# Altium project altium-senior-project-small.PrjPcb
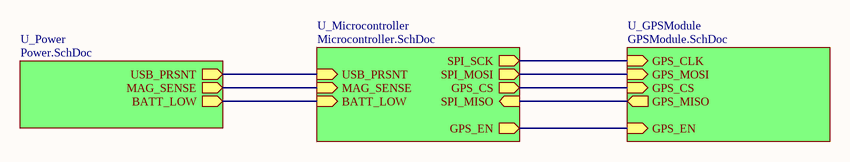
[diagram p0: topLevel.SchDoc]
4 sheets, 48 parts. Net scope: hierarchical (ports join the sheet entries above them; power ports are global).
Board file: smallCollar_AA.PcbDoc
Sheets:
  topLevel.SchDoc
    U_Microcontroller = Microcontroller.SchDoc
    U_GPSModule = GPSModule.SchDoc
    U_Power = Power.SchDoc

## Sheet topLevel.SchDoc: Top Level Schematic
size A4; Revision: AA; SheetNumber: 1; SheetTotal: 4; ImagePath: "D:\git\altium-senior-project\gvsu_logo.jpg"

### Sub-sheets
U_GPSModule = GPSModule.SchDoc: GPS_CLK (in), GPS_MISO (out), GPS_MOSI (in), GPS_CS (in), GPS_EN (in)
U_Microcontroller = Microcontroller.SchDoc: SPI_SCK (out), SPI_MISO (in), SPI_MOSI (out), GPS_CS (out), GPS_EN (out), USB_PRSNT (in), MAG_SENSE (in), BATT_LOW (in)
U_Power = Power.SchDoc: USB_PRSNT (out), MAG_SENSE (out), BATT_LOW (out)

### Nets
GPS_CS: sheet U_Microcontroller/GPS_CS, sheet U_GPSModule/GPS_CS
MISO: sheet U_Microcontroller/SPI_MISO, sheet U_GPSModule/GPS_MISO
MOSI: sheet U_Microcontroller/SPI_MOSI, sheet U_GPSModule/GPS_MOSI
SCK: sheet U_Microcontroller/SPI_SCK, sheet U_GPSModule/GPS_CLK
NetQ2_2: sheet U_Microcontroller/USB_PRSNT, sheet U_Power/USB_PRSNT
NetR1_2: sheet U_Microcontroller/MAG_SENSE, sheet U_Power/MAG_SENSE
NetR5_1: sheet U_Microcontroller/GPS_EN, sheet U_GPSModule/GPS_EN
NetU3_25: sheet U_Microcontroller/BATT_LOW, sheet U_Power/BATT_LOW

### Notes on the sheet
- Title
- Size:
- Date:
- A4
- Number:
- Time:
- Revision:
- Sheet
- of
- Grand Valley State University
- 301 W Fulton St
- Grand Rapids, MI
- 49504
- File:

## Sheet Microcontroller.SchDoc: Microcontroller
size A4; Revision: AA; SheetNumber: 3; SheetTotal: 4; ImagePath: "D:\git\altium-senior-project\gvsu_logo.jpg"
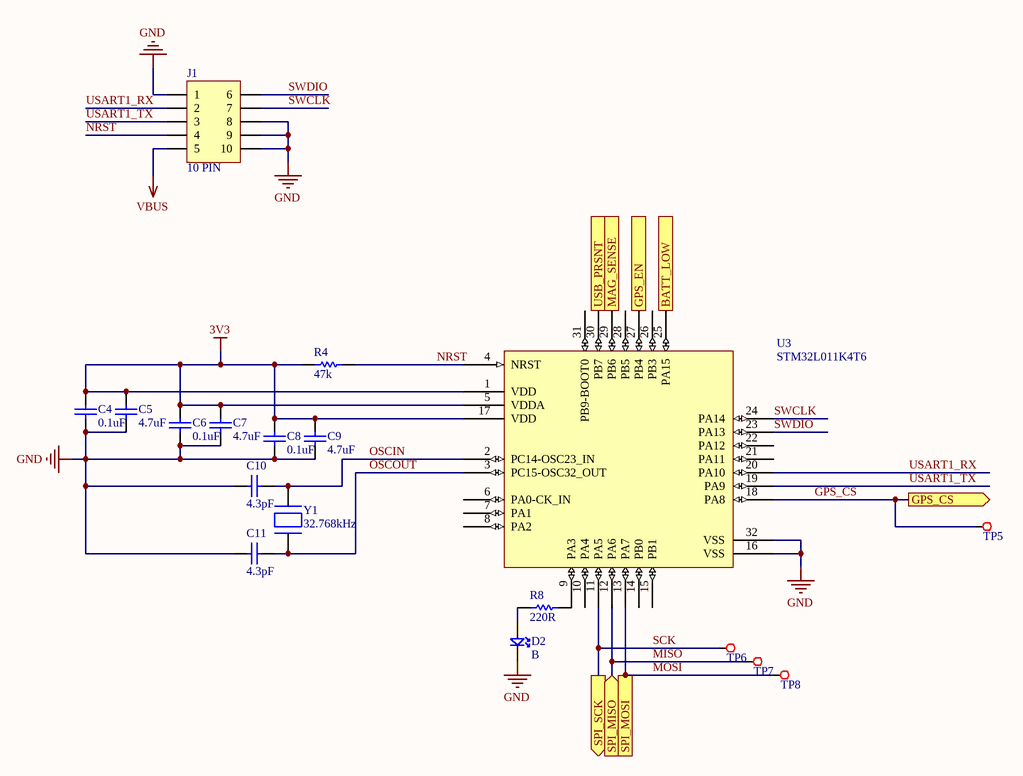
[diagram p1: Microcontroller.SchDoc]

### Parts
C4  value 0.1uF  [0603CAP]  (hidden comment: C0603)
C5  value 4.7uF  [0603CAP]  (hidden comment: C0603)
C6  value 0.1uF  [0603CAP]  (hidden comment: C0603)
C7  value 4.7uF  [0603CAP]  (hidden comment: C0603)
C8  value 0.1uF  [0603CAP]  (hidden comment: C0603)
C9  value 4.7uF  [0603CAP]  (hidden comment: C0603)
C10  value 4.3pF  [0402cap]  (hidden comment: C0402)
C11  value 4.3pF  [0402cap]  (hidden comment: C0402)
D2  value B  [0603DDE]  (hidden comment: D0603)
J1  10 PIN  [FTSH-105-01-F-D-K]
R4  value 47k  [0402RES]  (hidden comment: R0402)
R8  value 220R  [0402RES]  (hidden comment: R0402)
TP5  TESTPOINT  [TP R25]  (value not drawn)  (no BOM)
TP6  TESTPOINT  [TP R35 TH15]  (value not drawn)  (no BOM)
TP7  TESTPOINT  [TP R35 TH15]  (value not drawn)  (no BOM)
TP8  TESTPOINT  [TP R35 TH15]  (value not drawn)  (no BOM)
U3  STM32L011K4T6  [LQFP32]
Y1  32.768kHz  [0.126" L x 0.061" W (2 PAD)]

### Ports
BATT_LOW (in), GPS_CS (out), GPS_EN (out), MAG_SENSE (in), SPI_MISO (in), SPI_MOSI (out), SPI_SCK (out), USB_PRSNT (in)

### Nets
3V3: C4.2 C5.2 C6.2 C7.2 C8.2 C9.2 R4.1 U3.1(VDD) U3.5(VDDA) U3.17(VDD)
GND: C4.1 C5.1 C6.1 C7.1 C8.1 C9.1 C10.1 C11.1 D2.2 J1.1 J1.8 J1.9 J1.10 U3.16(VSS) U3.32(VSS)
VBUS: J1.5
GPS_CS: TP5.1 U3.18(PA8) ; port GPS_CS
MISO: TP7.1 U3.12(PA6) ; port SPI_MISO
MOSI: TP8.1 U3.13(PA7) ; port SPI_MOSI
NRST: J1.4 R4.2 U3.4(NRST)
OSCIN: C10.2 U3.2(PC14-OSC23_IN) Y1.2
OSCOUT: C11.2 U3.3(PC15-OSC32_OUT) Y1.1
SCK: TP6.1 U3.11(PA5) ; port SPI_SCK
SWCLK: J1.7 U3.24(PA14)
SWDIO: J1.6 U3.23(PA13)
USART1_RX: J1.2 U3.20(PA10)
USART1_TX: J1.3 U3.19(PA9)
NetD2_1: D2.1 R8.1
NetQ2_2: U3.30(PB7) ; port USB_PRSNT
NetR1_2: U3.29(PB6) ; port MAG_SENSE
NetR5_1: U3.27(PB4) ; port GPS_EN
NetR8_2: R8.2 U3.9(PA3)
NetU3_25: U3.25(PA15) ; port BATT_LOW

Not connected (* = marked no-connect by the designer): U3 6(PA0-CK_IN) 7(PA1) 8(PA2) 10(PA4) 14(PB0) 15(PB1) 21(PA11) 22(PA12) 26(PB3) 28(PB5) 31(PB9-BOOT0)

### Notes on the sheet
- Title
- Size:
- Date:
- A4
- Number:
- Time:
- Revision:
- Sheet
- of
- Grand Valley State University
- 301 W Fulton St
- Grand Rapids, MI
- 49504
- File:

### Library data of the parts
C4-C9 = C0603: 0603 Ceramic Chip Capacitor - Standard
C10 C11 = C0402: 0402 Ceramic Chip Capacitor - Standard
D2 = D0603: 0603 SMD LED; ComponentLink1URL: *; Forward Voltage Drop: *
J1 = FTSH-105-01-F-D-K: 10 Pin Programming Header; Manufacturer 1: Samtec Inc.; Manufacturer Part Number 1: FTSH-105-01-F-D-K; Supplier 1: Digikey; Supplier Part Number 1: SAM8909-ND
R4 R8 = R0402: 0402 Chip Resistor - Standard; ComponentLink1URL: *
TP5 = TP25: 0.025" Round Test Point; Part Number: 1613; Part Name: Testpoint
TP6-TP8 = TP35TH10: 0.035"/0.015" Thru Hole Test Point; Part Number: 1617; Part Name: Testpoint
U3 = STM32L011K4T6: STMicro ARM M0+ Microcontroller; Manufacturer 1: STMicroelectronics; Manufacturer Part Number 11: STM32L071KZT6; Supplier 1: Digikey; Supplier Part Number 1: 497-18578-ND
Y1 = NX3215SA-32.768K-STD-MUA-8: NDK RTC 12.5pF Crystal SMD; Manufacturer 1: NDK; Manufacturer Part Number 1: NX3215SA-32.768K-STD-MUA-8; Supplier 1: Digikey; Supplier Part Number 1: 644-1156-1-ND

## Sheet GPSModule.SchDoc: GPS Module
size A4; Revision: AA; SheetNumber: 2; SheetTotal: 4
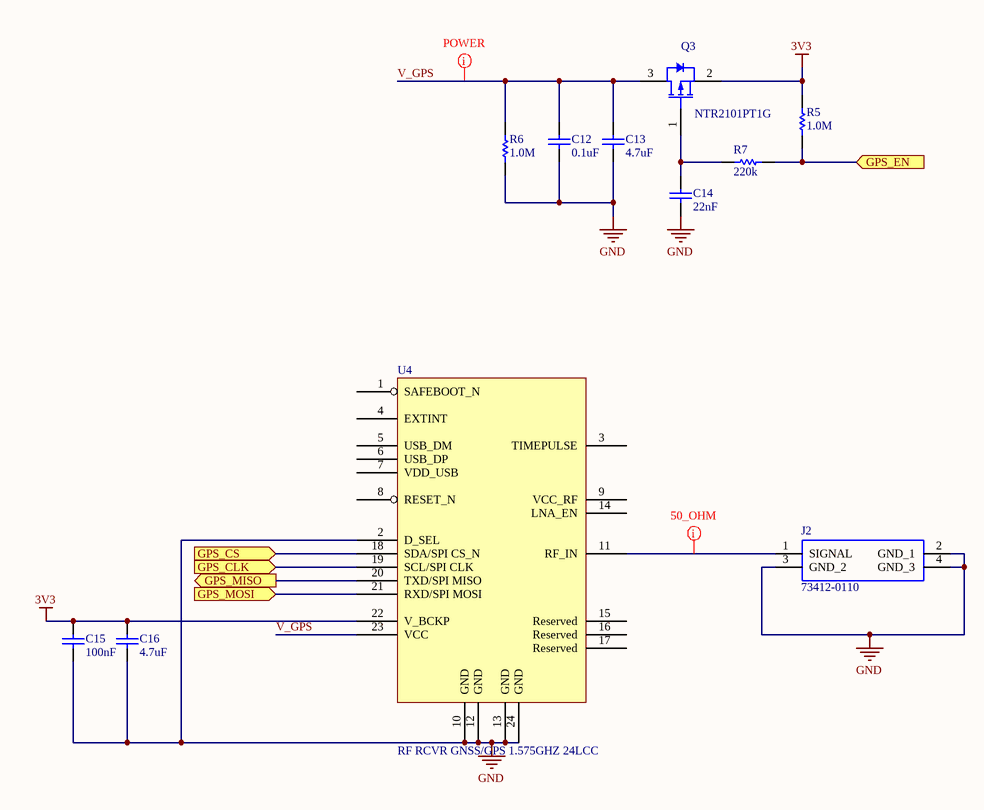
[diagram p2: GPSModule.SchDoc]

### Parts
C12  value 0.1uF  [0402cap]  (hidden comment: C0402)
C13  value 4.7uF  [0603CAP]  (hidden comment: C0603)
C14  value 22nF  [0402cap]  (hidden comment: C0402)
C15  value 100nF  [0402cap]  (hidden comment: C0402)
C16  value 4.7uF  [0603CAP]  (hidden comment: C0603)
J2  73412-0110  [73412-0110]
Q3  NTR2101PT1G  [ONSC-SOT-23-3-318-08_V]
R5  value 1.0M  [0402RES]  (hidden comment: R0402)
R6  value 1.0M  [0402RES]  (hidden comment: R0402)
R7  value 220k  [0402RES]  (hidden comment: R0402)
U4  RF RCVR GNSS/GPS 1.575GHZ 24LCC  [NEO-M8N-0]

### Ports
GPS_CLK (in), GPS_CS (in), GPS_EN (in), GPS_MISO (out), GPS_MOSI (in)

### Nets
3V3: C15.2 C16.2 Q3.2(S) R5.2 U4.22(V_BCKP)
GND: C12.1 C13.1 C14.1 C15.1 C16.1 J2.2(GND_1) J2.3(GND_2) J2.4(GND_3) R6.1 U4.2(D_SEL) U4.10(GND) U4.12(GND) U4.13(GND) U4.24(GND)
GPS_CS: U4.18(SDA/SPI_CS_N) ; port GPS_CS
MISO: U4.20(TXD/SPI_MISO) ; port GPS_MISO
MOSI: U4.21(RXD/SPI_MOSI) ; port GPS_MOSI
SCK: U4.19(SCL/SPI_CLK) ; port GPS_CLK
V_GPS: C12.2 C13.2 Q3.3(D) R6.2 U4.23(VCC)
NetC14_2: C14.2 Q3.1(G) R7.2
NetJ2_1: J2.1(SIGNAL) U4.11(RF_IN)
NetR5_1: R5.1 R7.1 ; port GPS_EN

Not connected (* = marked no-connect by the designer): U4 1(SAFEBOOT_N) 3(TIMEPULSE) 4(EXTINT) 5(USB_DM) 6(USB_DP) 7(VDD_USB) 8(RESET_N) 9(VCC_RF) 14(LNA_EN) 15(Reserved) 16(Reserved) 17(Reserved)

### Layout directives
net class POWER: V_GPS
net class 50 OHM: NetJ2_1

### Notes on the sheet
- Title
- Size:
- Date:
- A4
- Number:
- Time:
- Revision:
- Sheet
- of
- Grand Valley State University
- 301 W Fulton St
- Grand Rapids, MI
- 49504
- File:

### Library data of the parts
C12 C14 C15 = C0402: 0402 Ceramic Chip Capacitor - Standard
C13 C16 = C0603: 0603 Ceramic Chip Capacitor - Standard
J2 = 73412-0110: 50 Ohms, MCRF, PCB Vertical Jack Receptacle, SMT, 1.25mm Mounted Height; Manufacturer 1: Molex; Allied_Number: 70357960; Manufacturer Part Number 1: 73412-0110; RS Part Number: 1676350; RS Price/Stock: http://uk.rs-online.com/web/p/products/1676350; Allied Price/Stock: https://www.alliedelec.com/molex-incorporated-73412-0110/70357960/; Mouser Part Number: 538-73412-0110; Mouser Price/Stock: https://www.mouser.com/Search/Refine.aspx?Keyword=538-73412-0110; Datasheet Link: http://www.molex.com/pdm_docs/sd/734120110_sd.pdf; Supplier 1: Digi-Key; Supplier Part Number 1: WM5587CT-ND
Q3 = NTR2101PT1G: Small Signal MOSFET, -8 V, -3.7 A, Single P-Channel, 3-Pin SOT-23, Pb-Free, Tape and Reel; Manufacturer 1: On Semiconductor; Channel Polarity: P Channel; Ciss Typ (pF): 1173; Coss Typ (pF): 289; Crss Typ (pF): 218; ID Max (A): 3.7; PD Max (W): 0.96; V(BR)DSS Min (V): 8; VGS(th) Max (V): 1; DatasheetVersion: Rev. 6; PackageVersion: Rev. AP, 11/2009; PackageReference: SOT-23-3-318-08; PackageDescription: 3-Pin Small Outline Transistor, Body 2.92 x 1.3 mm, Pitch 0.95 mm; Configuration: Single; Package Type: SOT-23-3; Packing: Tape and Reel; RoHS: Pb-Free; VGS Max (V): 8; Mounting Technology: Surface Mount; Manufacturer Part Number 1: NTR2101PT1G; ComponentLink1Description: Manufacturer URL; ComponentLink1URL: http://www.onsemi.com/; ComponentLink2Description: Datasheet; ComponentLink2URL: http://www.onsemi.cn/pub_link/Collateral/NTR2101P-D.PDF; ComponentLink3Description: Package Specification; ComponentLink3URL: http://www.onsemi.cn/pub_link/Collateral/318-08.PDF
R5-R7 = R0402: 0402 Chip Resistor - Standard; ComponentLink1URL: *
U4 = NEO-M8N-0: Concurrent GNSS LCC module, TCXO, Flash, SAW, LNA; Manufacturer 1: U-Blox America Inc.; Manufacturer Part Number 1: NEO-M8N-0; Supplier 1: Digi-Key; Supplier Part Number 1: 672-1008-1-ND

## Sheet Power.SchDoc: Power Selection
size A4; Revision: AA; SheetNumber: 4; SheetTotal: 4
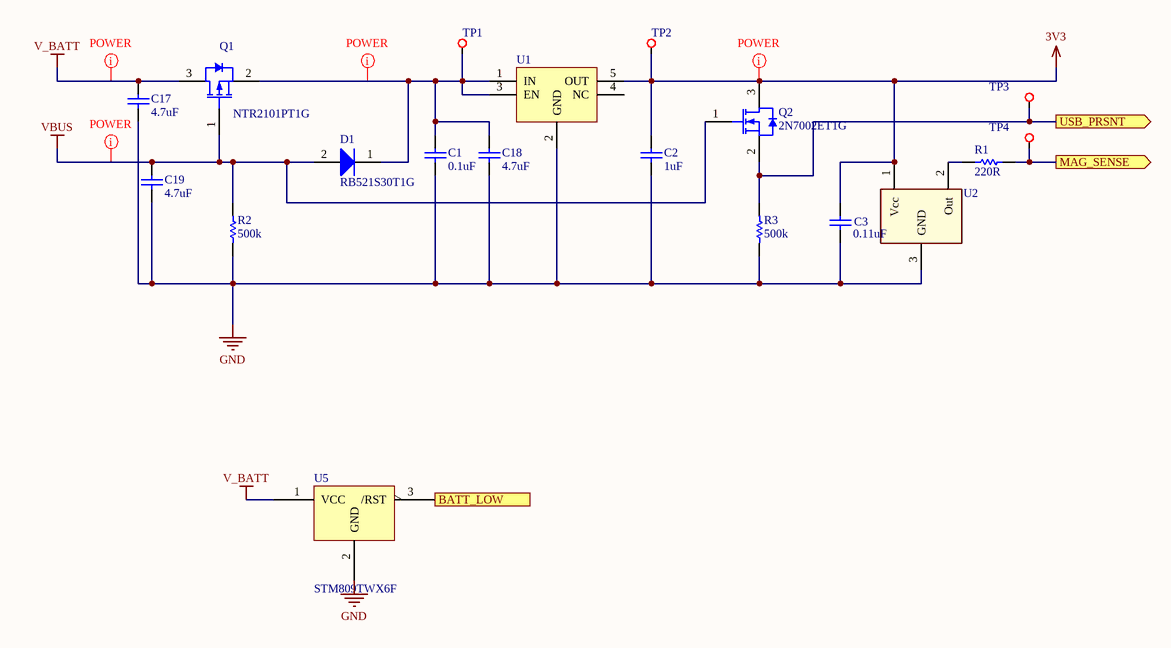
[diagram p3: Power.SchDoc]

### Parts
C1  value 0.1uF  [0402cap]  (hidden comment: C0402)
C2  value 1uF  [0402cap]  (hidden comment: C0402)
C3  value 0.11uF  [0402cap]  (hidden comment: C0402)
C17  value 4.7uF  [0603CAP]  (hidden comment: C0603)
C18  value 4.7uF  [0603CAP]  (hidden comment: C0603)
C19  value 4.7uF  [0603CAP]  (hidden comment: C0603)
D1  RB521S30T1G  [ONSC-SOD-523-2-502-01_V]
Q1  NTR2101PT1G  [ONSC-SOT-23-3-318-08_V]
Q2  2N7002ET1G  [ONSC-SOT-23-3-318-08_V]
R1  value 220R  [0402RES]  (hidden comment: R0402)
R2  value 500k  [0402RES]  (hidden comment: R0402)
R3  value 500k  [0402RES]  (hidden comment: R0402)
TP1  TESTPOINT  [TP R25]  (value not drawn)  (no BOM)
TP2  TESTPOINT  [TP R25]  (value not drawn)  (no BOM)
TP3  TESTPOINT  [TP R25]  (value not drawn)  (no BOM)
TP4  TESTPOINT  [TP R25]  (value not drawn)  (no BOM)
U1  IC REG LINEAR 3.3V 200MA ESV  [TCR2EE33,LM(CT]  (value not drawn)
U2  DRV5032FBDBZT  [SOT-23]  (value not drawn)
U5  STM809TWX6F  [SOT103P237X112-3N]

### Ports
BATT_LOW (out), MAG_SENSE (out), USB_PRSNT (out)

### Nets
3V3: C2.2 C3.2 Q2.3(D) TP2.1 U1.5(OUT) U2.1(Vcc)
GND: C1.1 C2.1 C3.1 C17.1 C18.1 C19.1 R2.1 R3.1 U1.2(GND) U2.3(GND) U5.2(GND)
V_BATT: C17.2 Q1.3(D) U5.1(VCC)
VBUS: C19.2 D1.2(A) Q1.1(G) Q2.1(G) R2.2
NetC1_2: C1.2 C18.2 D1.1(K) Q1.2(S) TP1.1 U1.1(IN) U1.3(EN)
NetQ2_2: Q2.2(S) R3.2 TP3.1 ; port USB_PRSNT
NetR1_1: R1.1 U2.2(Out)
NetR1_2: R1.2 TP4.1 ; port MAG_SENSE
NetU3_25: U5.3(/RST) ; port BATT_LOW

Not connected (* = marked no-connect by the designer): U1 4(NC)

### Layout directives
net class POWER: 3V3, NetC1_2, V_BATT, VBUS

### Notes on the sheet
- Title
- Size:
- Date:
- A4
- Number:
- Time:
- Revision:
- Sheet
- of
- Grand Valley State University
- 301 W Fulton St
- Grand Rapids, MI
- 49504
- File:

### Library data of the parts
C1-C3 = C0402: 0402 Ceramic Chip Capacitor - Standard
C17-C19 = C0603: 0603 Ceramic Chip Capacitor - Standard
D1 = CMP-1051-00018-1: Schottky Barrier Diode, 2-Pin SOD-523, Pb-Free, Tape and Reel; Manufacturer: On Semiconductor; Configuration: Single; IFSM Max (A): 1; Mounting Technology: Surface Mount; ComponentLink1Description: Manufacturer URL; PackageReference: SOD-523-2-502-01; RoHS: TRUE; ComponentLink3Description: Package Specification; ComponentLink2Description: Datasheet; PackageVersion: Rev. E, 09/2010; PartNumber: RB521S30T1G; ComponentLink3URL: http://www.onsemi.com/pub_link/Collateral/502-01.PDF; ComponentLink1URL: http://www.onsemi.com/; PackageDescription: 2-Pin SOD, Body 1.2 x 0.8 mm; DatasheetVersion: Rev. 8; ComponentLink2URL: http://www.onsemi.cn/pub_link/Collateral/RB521S30T1-D.PDF; Packing: Tape and Reel
Q1 = NTR2101PT1G: Small Signal MOSFET, -8 V, -3.7 A, Single P-Channel, 3-Pin SOT-23, Pb-Free, Tape and Reel; Manufacturer: On Semiconductor; Channel Polarity: P Channel; Ciss Typ (pF): 1173; Coss Typ (pF): 289; Crss Typ (pF): 218; ID Max (A): 3.7; PD Max (W): 0.96; V(BR)DSS Min (V): 8; VGS(th) Max (V): 1; DatasheetVersion: Rev. 6; PackageVersion: Rev. AP, 11/2009; PackageReference: SOT-23-3-318-08; PackageDescription: 3-Pin Small Outline Transistor, Body 2.92 x 1.3 mm, Pitch 0.95 mm; Configuration: Single; Package Type: SOT-23-3; Packing: Tape and Reel; RoHS: Pb-Free; VGS Max (V): 8; Mounting Technology: Surface Mount; PartNumber: NTR2101PT1G; ComponentLink1Description: Manufacturer URL; ComponentLink1URL: http://www.onsemi.com/; ComponentLink2Description: Datasheet; ComponentLink2URL: http://www.onsemi.cn/pub_link/Collateral/NTR2101P-D.PDF; ComponentLink3Description: Package Specification; ComponentLink3URL: http://www.onsemi.cn/pub_link/Collateral/318-08.PDF
Q2 = 2N7002ET1G: Small Signal MOSFET, 60 V, 310 mA, Single, N-Channel, 3-Pin SOT-23, Pb-Free, Tape and Reel; Manufacturer: On Semiconductor; Channel Polarity: N Channel; Ciss Typ (pF): 26.7; Coss Typ (pF): 4.6; Crss Typ (pF): 2.9; ID Max (A): 0.31; V(BR)DSS Min (V): 60; VGS Max (V): 20; VGS(th) Max (V): 2.5; DatasheetVersion: Rev. 3; PackageVersion: Rev. AP, 11/2009; PackageReference: SOT-23-3-318-08; PackageDescription: 3-Pin Small Outline Transistor, Body 2.92 x 1.3 mm, Pitch 0.95 mm; Supplier 1: Digi-Key; Supplier Part Number 1: 2N7002ET1GOSTR-ND; Supplier 2: Digi-Key; Supplier Part Number 2: 2N7002ET1GOSCT-ND; Supplier 3: Digi-Key; Supplier Part Number 3: 2N7002ET1GOSDKR-ND; Supplier 4: Farnell; Supplier Part Number 4: 2317895; Supplier 5: Farnell; Supplier Part Number 5: 2317616; Supplier 6: Newark; Supplier Part Number 6: 09R9861; Supplier 7: Newark; Supplier Part Number 7: 50M2216; Supplier 8: Mouser; Supplier Part Number 8: 863-2N7002ET1G; Configuration: Single; Package Type: SOT-23-3; Packing: Tape and Reel; RoHS: Pb-Free; Mounting Technology: Surface Mount; PartNumber: 2N7002ET1G; ComponentLink1Description: Manufacturer URL; ComponentLink1URL: http://www.onsemi.com/; ComponentLink2Description: Datasheet; ComponentLink2URL: http://www.onsemi.com/pub_link/Collateral/2N7002E-D.PDF; ComponentLink3Description: Package Specification; ComponentLink3URL: http://www.onsemi.cn/pub_link/Collateral/318-08.PDF
R1-R3 = R0402: 0402 Chip Resistor - Standard; ComponentLink1URL: *
TP1-TP4 = TP25: as TP5 on sheet Microcontroller; Part Name: Testpoint
U1 = TCR2EE33,LM(CT: Linear Voltage Regulator IC Positive Fixed 1 Output  200mA ESV; Manufacturer 1: Toshiba Semiconductor and Storage; Manufacturer Part Number 1: TCR2EE33,LM(CT; Supplier 1: Digikey; Supplier Part Number 1: TCR2EE33LM(CTCT-ND; ComponentLink1Description: Datasheet; ComponentLink1URL: https://toshiba.semicon-storage.com/info/docget.jsp?did=13794&prodName=TCR2EF45
U2 = DRV5032FBDBZT: Hall Effect Sensor; Manufacturer: *; Manufacturer PN: *; Vendor: *; Vendor PN: *; Price: *
U5 = STM809TWX6F: IC MPU RESET CIRC 3.08V SOT23; Manufacturer 1: STMicroelectronics; Manufacturer Part Number 1: STM809TWX6F; Supplier 1: Digi-Key; Supplier Part Number 1: 497-3339-1-ND; ComponentLink1Description: Datasheet; ComponentLink1URL: https://www.st.com/content/ccc/resource/technical/document/datasheet/cd/e2/ab/27/7d/5d/44/41/CD00003591.pdf/files/CD00003591.pdf/jcr:content/translations/en.CD00003591.pdf

## Nets that join several sheets
3V3: Microcontroller (10 pins), GPSModule (5 pins), Power (6 pins)
GND: Microcontroller (15 pins), GPSModule (14 pins), Power (11 pins)
VBUS: Microcontroller (J1.5), Power (5 pins)
GPS_CS: Microcontroller (TP5.1 U3.18), GPSModule (U4.18)
MISO: Microcontroller (TP7.1 U3.12), GPSModule (U4.20)
MOSI: Microcontroller (TP8.1 U3.13), GPSModule (U4.21)
NetQ2_2: Microcontroller (U3.30), Power (Q2.2 R3.2 TP3.1)
NetR1_2: Microcontroller (U3.29), Power (R1.2 TP4.1)
NetR5_1: Microcontroller (U3.27), GPSModule (R5.1 R7.1)
NetU3_25: Microcontroller (U3.25), Power (U5.3)
SCK: Microcontroller (TP6.1 U3.11), GPSModule (U4.19)